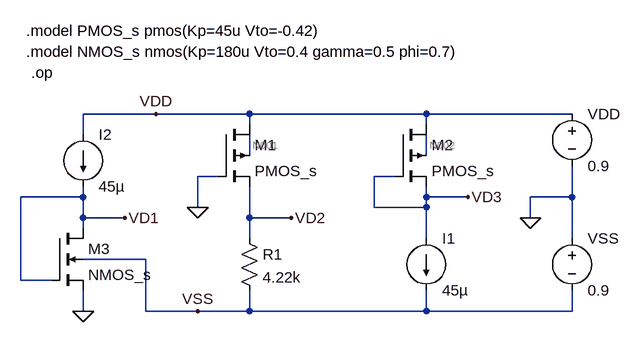
[diagram p0: schematic Week3_Problem2.asc]
Week3_Problem2.asc, the LTspice schematic file:
Version 4.1
SHEET 1 880 680
WIRE -272 64 -384 64
WIRE -128 64 -272 64
WIRE 144 64 -128 64
WIRE 368 64 144 64
WIRE -128 80 -128 64
WIRE 144 80 144 64
WIRE -384 96 -384 64
WIRE -128 128 -128 96
WIRE 144 128 144 96
WIRE -176 160 -208 160
WIRE 96 160 64 160
WIRE -384 192 -384 176
WIRE -384 192 -480 192
WIRE 144 192 144 176
WIRE 208 192 144 192
WIRE 368 192 368 144
WIRE 368 192 304 192
WIRE -208 208 -208 160
WIRE 64 208 64 160
WIRE 144 208 144 192
WIRE 144 208 64 208
WIRE -384 224 -384 192
WIRE -320 224 -384 224
WIRE -128 224 -128 176
WIRE -64 224 -128 224
WIRE 304 224 304 192
WIRE -384 240 -384 224
WIRE -128 256 -128 224
WIRE 144 256 144 208
WIRE 368 256 368 192
WIRE -288 288 -384 288
WIRE -480 320 -480 192
WIRE -432 320 -480 320
WIRE -384 368 -384 336
WIRE -288 368 -288 288
WIRE -208 368 -288 368
WIRE -128 368 -128 336
WIRE -128 368 -208 368
WIRE 144 368 144 336
WIRE 144 368 -128 368
WIRE 368 368 368 336
WIRE 368 368 144 368
FLAG -208 208 0
FLAG -384 368 0
FLAG 304 224 0
FLAG -320 224 VD1
FLAG -64 224 VD2
FLAG 208 192 VD3
FLAG -272 64 VDD
FLAG -208 368 VSS
SYMBOL voltage 368 48 R0
WINDOW 123 0 0 Left 0
WINDOW 39 0 0 Left 0
SYMATTR InstName VDD
SYMATTR Value 0.9
SYMBOL voltage 368 240 R0
WINDOW 123 0 0 Left 0
WINDOW 39 0 0 Left 0
SYMATTR InstName VSS
SYMATTR Value 0.9
SYMBOL current 144 256 R0
WINDOW 123 0 0 Left 0
WINDOW 39 0 0 Left 0
SYMATTR InstName I1
SYMATTR Value 45µ
SYMBOL current -384 96 R0
WINDOW 123 0 0 Left 0
WINDOW 39 0 0 Left 0
SYMATTR InstName I2
SYMATTR Value 45µ
SYMBOL res -144 240 R0
SYMATTR InstName R1
SYMATTR Value 4.22k
SYMBOL nmos4 -432 240 R0
SYMATTR InstName M3
SYMATTR Value NMOS_s
SYMATTR Value2 l=1u w=8u
SYMBOL pmos4 -176 80 R0
SYMATTR InstName M1
SYMATTR Value PMOS_s
SYMATTR Value2 l=1u w=32u
SYMBOL pmos4 96 80 R0
SYMATTR InstName M2
SYMATTR Value PMOS_s
SYMATTR Value2 l=1u w=32u
TEXT -472 -64 Left 2 !.model PMOS_s pmos(Kp=45u Vto=-0.42)
TEXT -472 -32 Left 2 !.model NMOS_s nmos(Kp=180u Vto=0.4 gamma=0.5 phi=0.7)
TEXT -464 0 Left 2 !.op

The netlist it stands for:
* Week3_Problem2.asc
VDD VDD 0 0.9
VSS 0 VSS 0.9
I1 VD3 VSS 45µ
I2 VDD VD1 45µ
R1 VD2 VSS 4.22k
M3 VD1 VD1 0 VSS NMOS_s l=1u w=8u
M1 VDD 0 VD2 N001 PMOS_s l=1u w=32u
M2 VDD VD3 VD3 N002 PMOS_s l=1u w=32u
.model NMOS NMOS
.model PMOS PMOS
.lib standard.mos
.model PMOS_s pmos(Kp=45u Vto=-0.42)
.model NMOS_s nmos(Kp=180u Vto=0.4 gamma=0.5 phi=0.7)
.op
.backanno
.end

* Results of the author's LTspice run, read from the files saved beside the schematic
* Operating Point:
*   V(vss) = -900 mV
*   V(vd1) = 864.1 mV
*   V(vd2) = -200 mV
*   V(n002) = 775.8 mV
*   V(vdd) = 900 mV
*   V(vd3) = 230 mV
*   V(n001) = 768.3 mV
*   I(VDD) = -255.9 µA
*   I(I1) = 45 µA
*   I(R1) = 165.9 µA
*   Id(M3) = 45 µA
*   Ig(M3) = 0 A
*   Is(M3) = -45 µA
*   Ib(M3) = -2.684 pA
*   Id(M2) = 45 µA
*   Ig(M2) = 0 A
*   Is(M2) = -45 µA
*   Ib(M2) = -775.8 fA
*   I(I2) = 45 µA
*   Id(M1) = 165.9 µA
*   Ig(M1) = 0 A
*   Is(M1) = -165.9 µA
*   Ib(M1) = -768.3 fA
*   I(VSS) = -210.9 µA